# EAGLE design TrinTheremin (EAGLE 7.6.0)
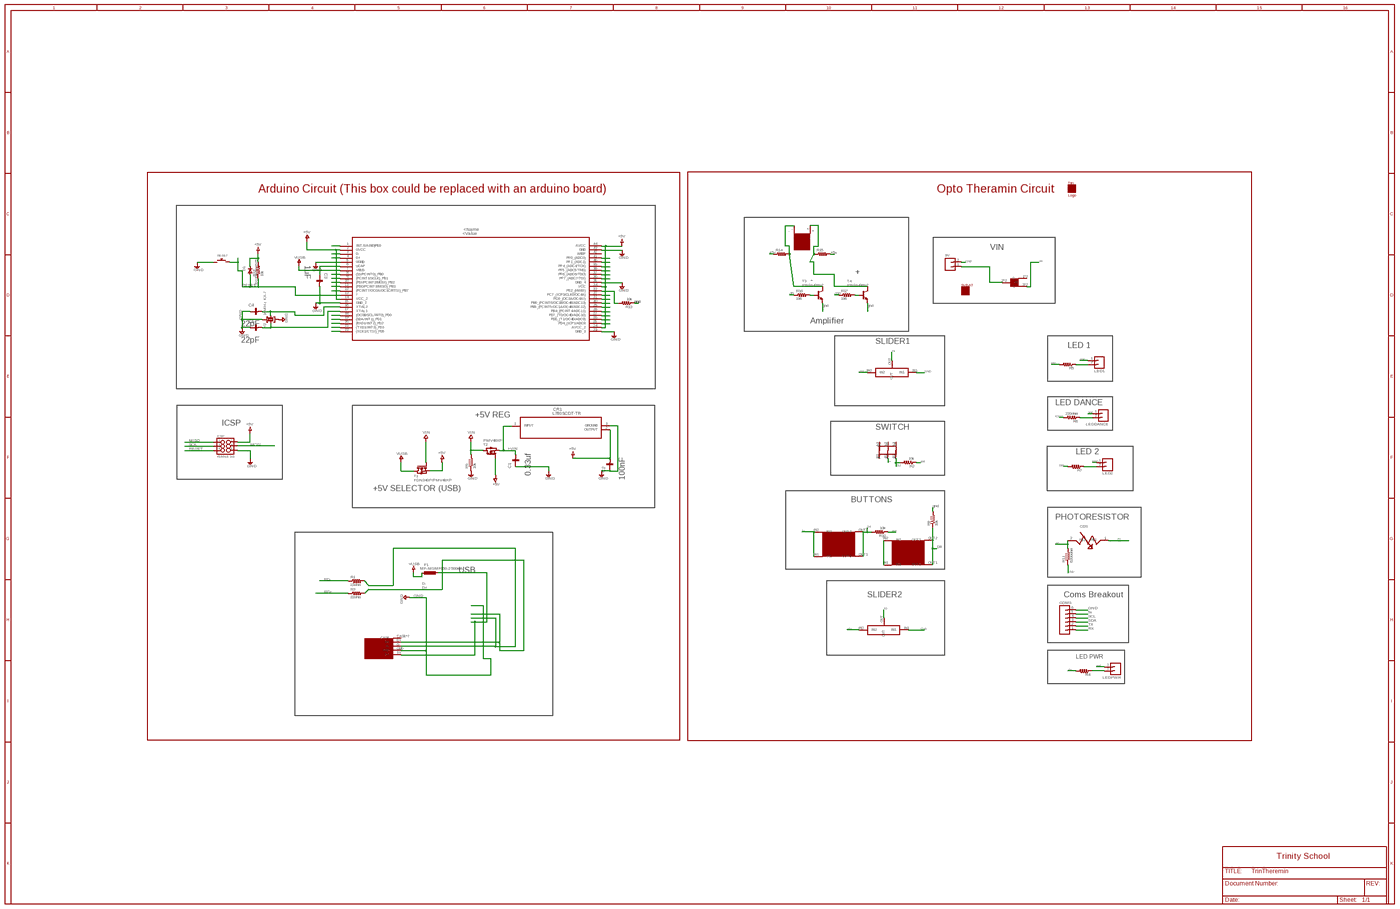
[diagram p0: schematic, sheet 1, overview]
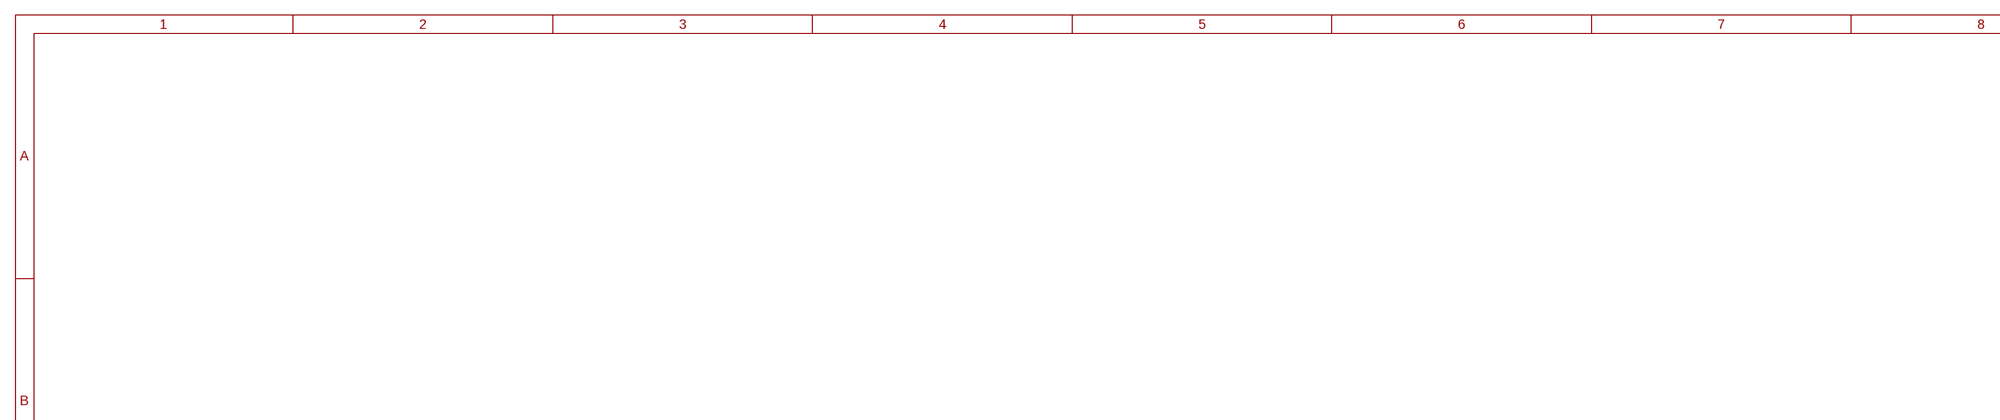
[diagram p1: schematic, sheet 1, part 1 of 4]
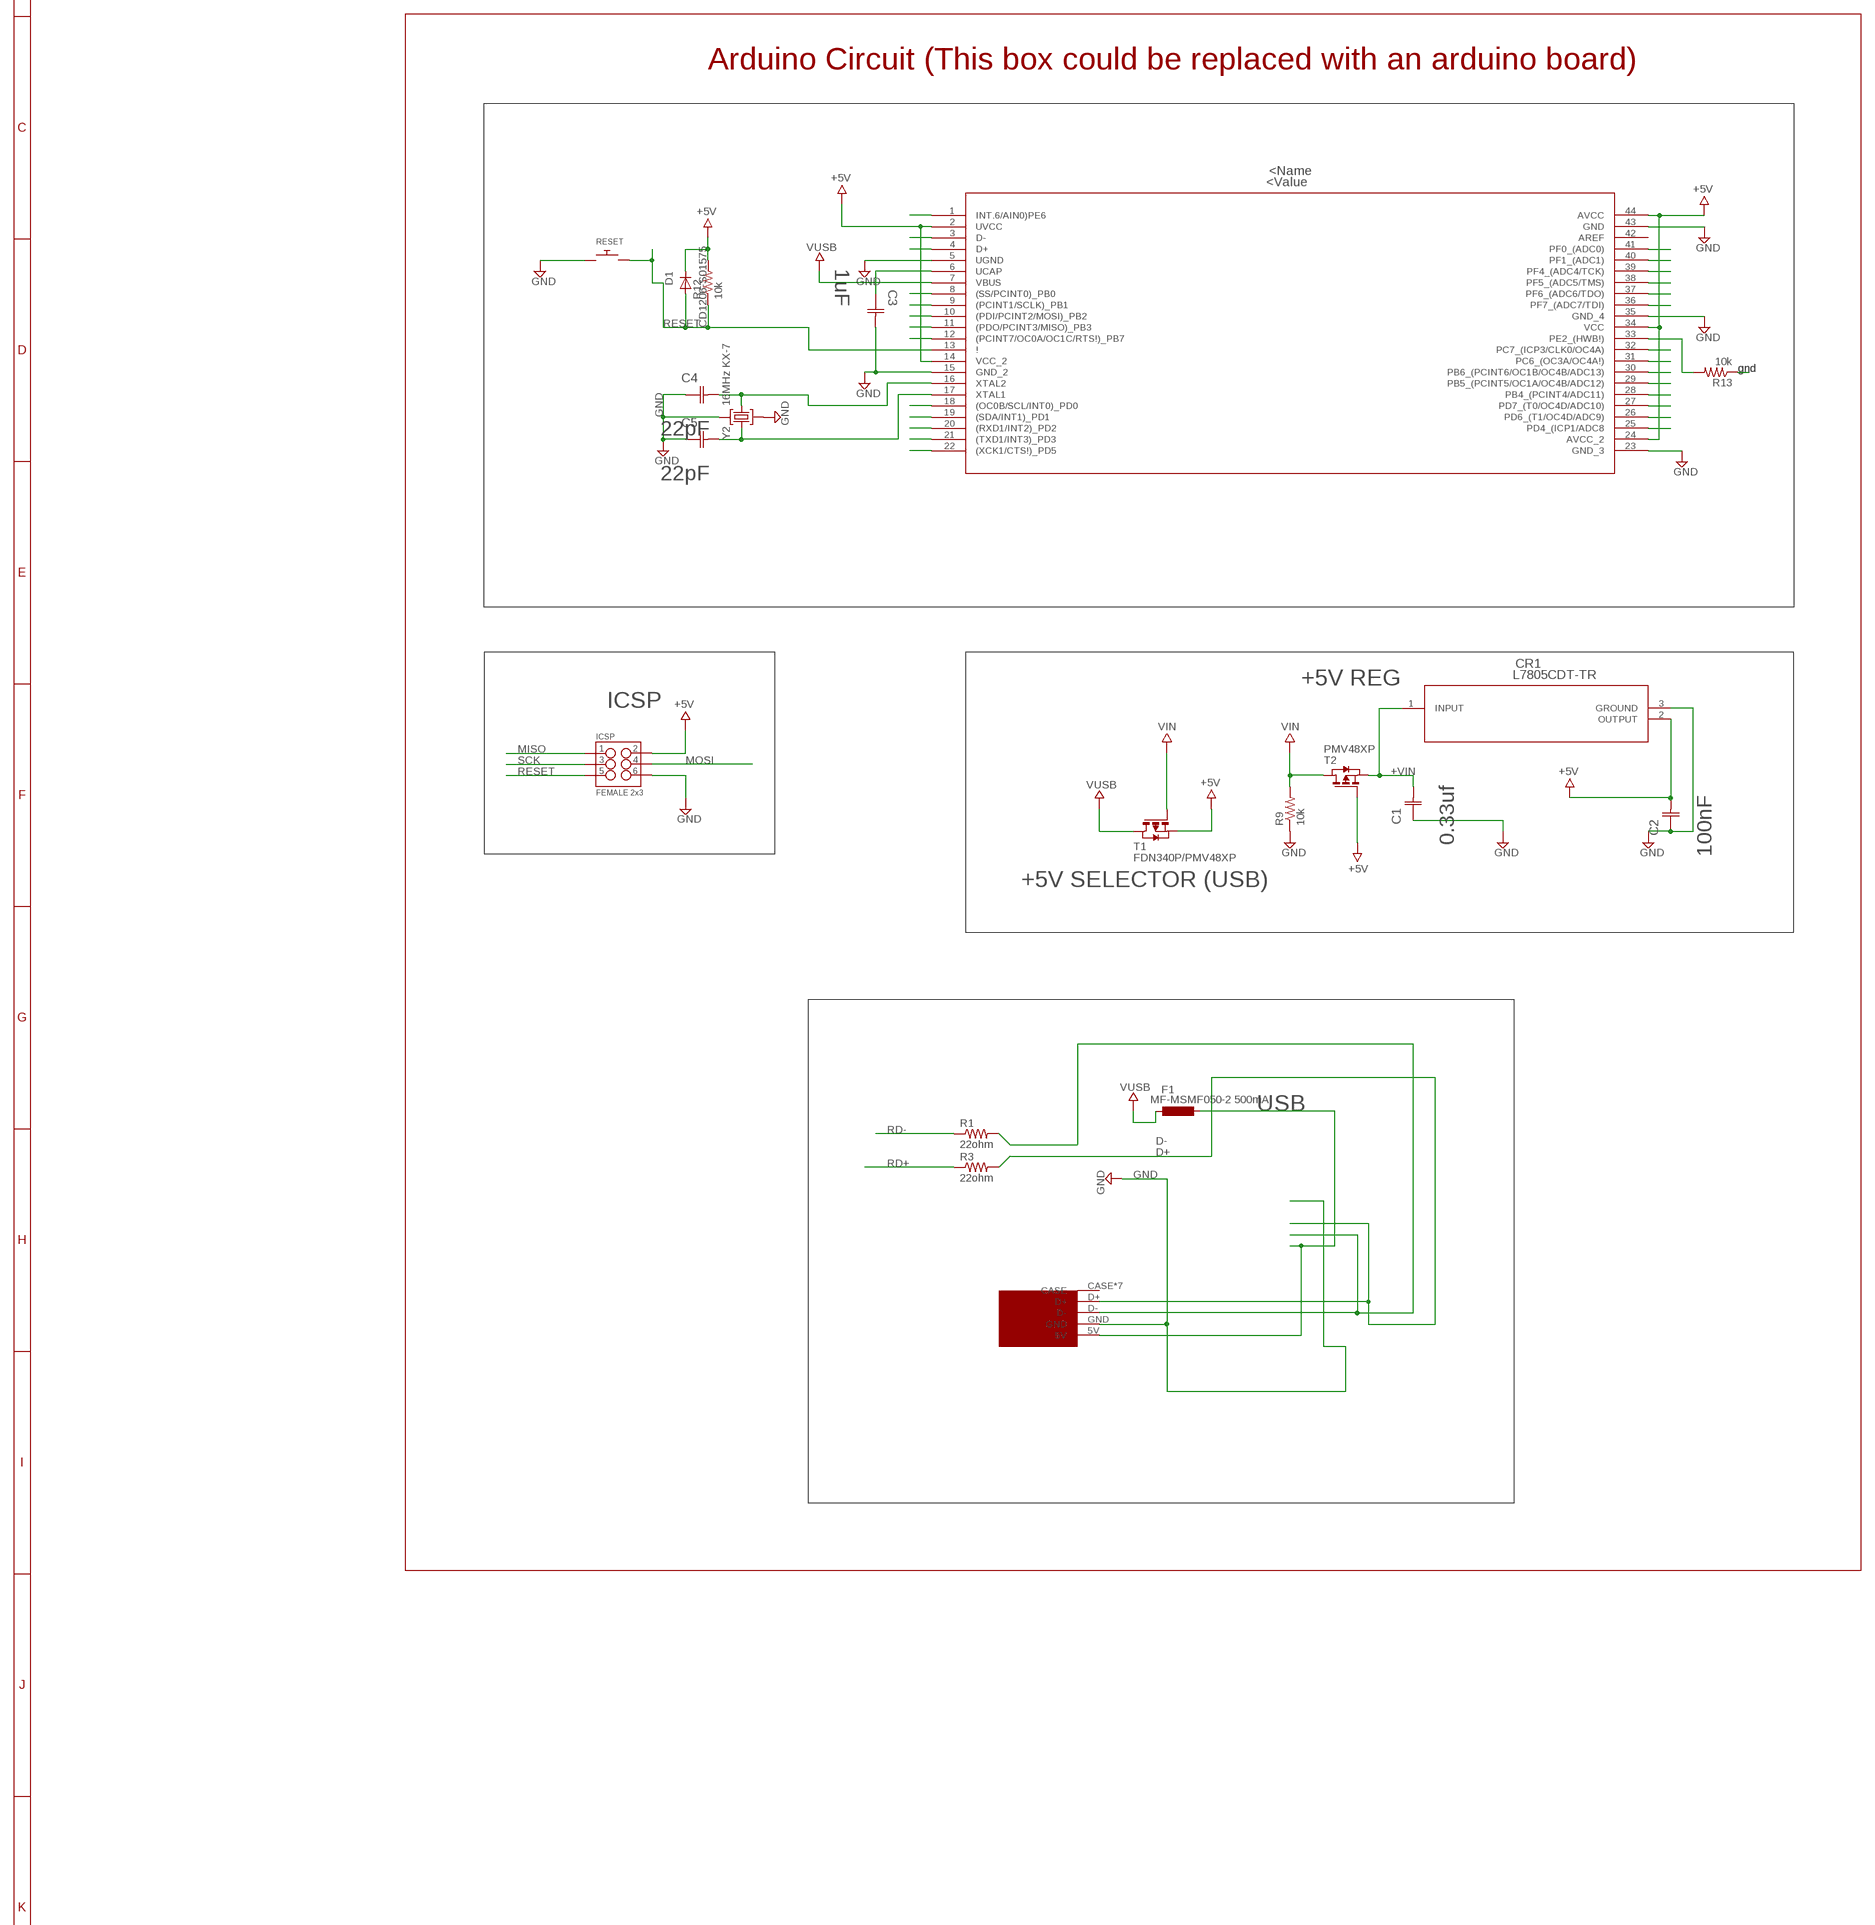
[diagram p2: schematic, sheet 1, part 2 of 4]
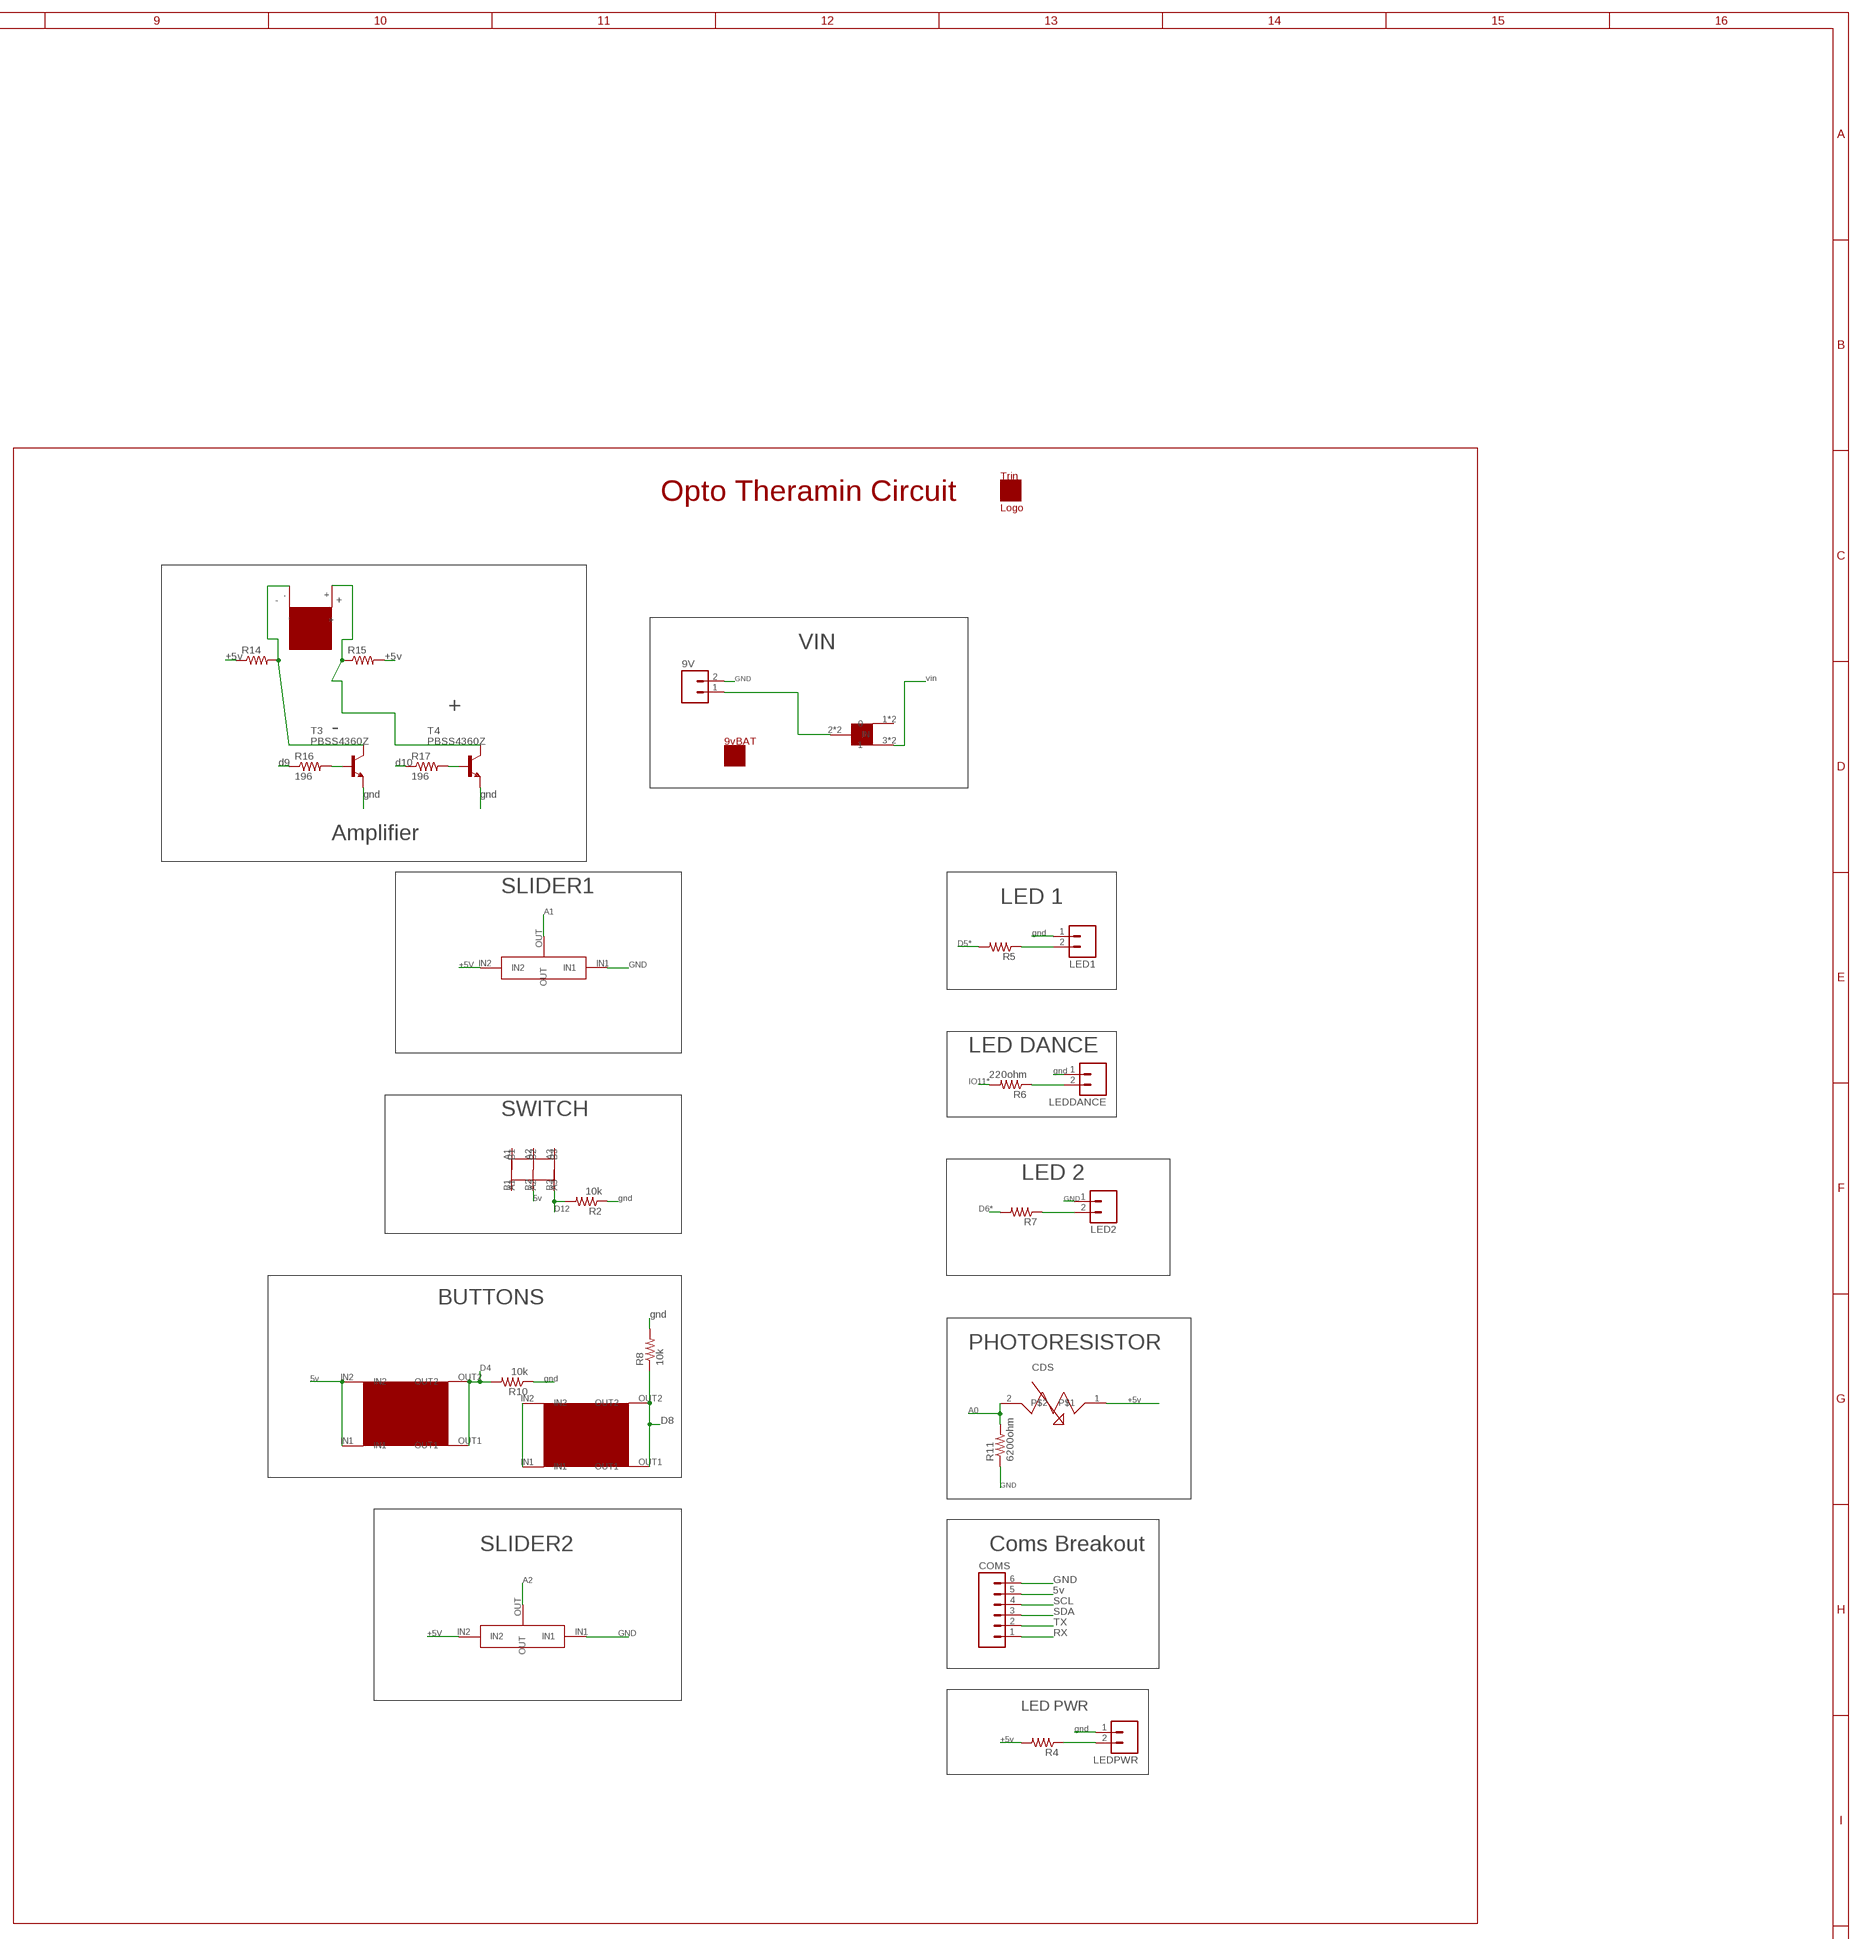
[diagram p3: schematic, sheet 1, part 3 of 4]
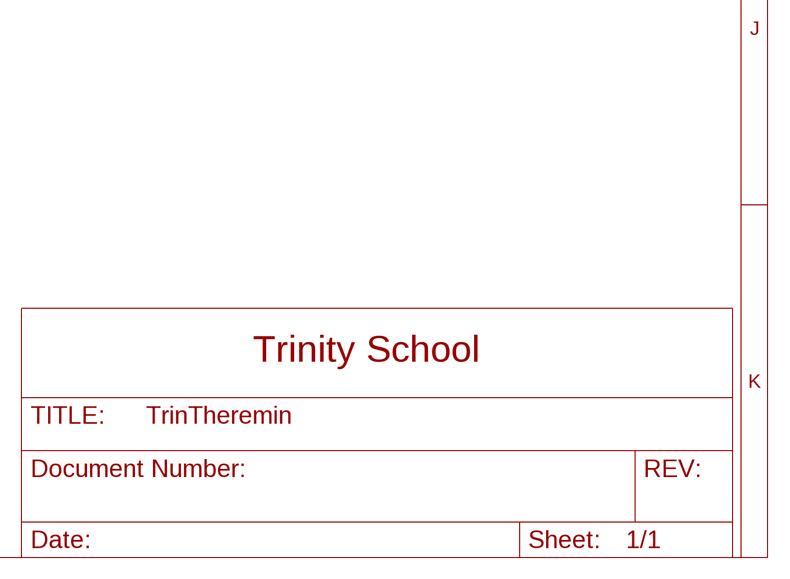
[diagram p4: schematic, sheet 1, part 4 of 4]

## Parts
9V  M02PTH  [1X02]
C1  0.33uf  C0805C104J5RACTU  [CAPC2013X110N]
C2  100nF  C0805C104J5RACTU  [CAPC2013X110N]
C3  1uF  C0603C105K3PACTU  [CAPC1608X85N]
C4  22pF  C0603C220J5GACTU  [CAPC1608X85N]
C5  22pF  C0603C220J5GACTU  [CAPC1608X85N]
COMS  M06SILK_FEMALE_PTH  [1X06]
CR1  L7805CDT-TR  [DPAK]
D1  CD1206-S01575  DIODE-MINIMELF  [MINIMELF]
F1  MF-MSMF050-2 500mA  L-EUL1812  [L1812]
ICSP  FEMALE 2x3  M03X2FEMALE  [2X3]
LED1  M02PTH  [1X02]
LED2  M02PTH  [1X02]
LEDDANCE  M02PTH  [1X02]
LEDPWR  M02PTH  [1X02]
R1  22ohm  R-US_R0603  [R0603]
R2  10k  RESISTOR0603  [0603-RES]
R3  22ohm  R-US_R0603  [R0603]
R4  RESISTOR0603  [0603-RES]
R5  RESISTOR0603  [0603-RES]
R6  220ohm  RESISTOR0603  [0603-RES]
R7  RESISTOR0603  [0603-RES]
R8  10k  RESISTOR0603  [0603-RES]
R9  10k  RESISTOR0603  [0603-RES]
R10  10k  RESISTOR0603  [0603-RES]
R11  6200ohm  RESISTOR0603  [0603-RES]
R12  10k  RESISTOR0603  [0603-RES]
R13  10k  RESISTOR0603  [0603-RES]
R14  R-US_R2512  [R2512]
R15  R-US_R2512  [R2512]
R16  196  RESISTOR1206  [1206]
R17  196  RESISTOR1206  [1206]
RESET  SWITCH_PUSHBUTTONC&K_KSS  [BTN_CK_KSS]
T1  FDN340P/PMV48XP  PMOSSOT23  [SOT-23]
T2  PMV48XP  PMOSSOT23  [SOT-23]
T3  PBSS4360Z  [SOT223]
T4  PBSS4360Z  [SOT223]
U$3  ATMEGA32U4-AU  [44ML]
U$8  PWRSWITCHTHRU  [PWRSWITCHTHRU]
U$9  CDS  [CDS]
U$10  DIGISLIDER  [DIGISLIDER]
U$11  DIGISWITCH  [DIGISWITCH]
U$13  BUT97  [BUT97]
U$14  DIGISLIDER  [DIGISLIDER]
U$15  9VBATHOLDERTALL  [9VBATHOLDERTALL]
U$16  TRIN  [TRIN]
U$17  BUT97  [BUT97]
U$20  GOODSPEAKER  [GOODSPEAKER]
U$23  MICROUSB  [MICROUSB]
Y2  16MHz KX-7  CRYSTAL-3.2-2.5  [CRYSTAL-3.2-2.5]

## Nets
+5V: C2.2(C2) COMS.5 CR1.2(OUTPUT) D1.C ICSP.2 R4.2 R12.2 R14.1 R15.2 T1.2(S) T2.3(G) U$3.2(UVCC) U$3.14(VCC_2) U$3.24(AVCC_2) U$3.34(VCC) U$3.44(AVCC) U$9.1 U$10.IN2 U$11.B2 U$13.IN1 U$13.IN2 U$14.IN2 U$17.IN1 U$17.IN2
+VIN: C1.2(C2) CR1.1(INPUT) T2.2(S)
A0: R11.2 U$3.36(PF7_(ADC7/TDI)) U$9.2
A1: U$3.37(PF6_(ADC6/TDO)) U$10.OUT
A2: U$3.38(PF5_(ADC5/TMS)) U$14.OUT
A3: U$3.39(PF4_(ADC4/TCK))
A4: U$3.40(PF1_(ADC1))
A5: U$3.41(PF0_(ADC0))
BASE: R16.2 T3.1(B)
COL: R14.2 T3.2(C) T3.4(C) U$20.-
D0/RX: COMS.1 U$3.20((RXD1/INT2)_PD2)
D1/TX: COMS.2 U$3.21((TXD1/INT3)_PD3)
D2/SDA: COMS.3 U$3.19((SDA/INT1)_PD1)
D3/SCL: COMS.4 U$3.18((OC0B/SCL/INT0)_PD0)
D4*: R10.2 U$3.25(PD4_(ICP1/ADC8) U$13.OUT1 U$13.OUT2
D5*: R5.2 U$3.31(PC6_(OC3A/OC4A!))
D6*: R7.2 U$3.27(PD7_(T0/OC4D/ADC10))
D7: U$3.1(INT.6/AIN0)PE6)
D+: R3.2 U$23.D+
D-: R1.2 U$23.D-
GND: 9V.2 C1.1(C1) C2.1(C1) C3.2(C2) C4.1(C1) C5.1(C1) COMS.6 CR1.3(GROUND) ICSP.6 LED1.1 LED2.1 LEDDANCE.1 LEDPWR.1 R2.1 R8.2 R9.1 R10.1 R11.1 R13.1 RESET.P$1 T3.3(E) T4.3(E) U$3.5(UGND) U$3.15(GND_2) U$3.23(GND_3) U$3.35(GND_4) U$3.43(GND) U$10.IN1 U$14.IN1 U$23.GND Y2.2(GND) Y2.4(GND)
HWB: R13.2 U$3.33(PE2_(HWB!))
IO8: R8.1 U$3.28(PB4_(PCINT4/ADC11)) U$17.OUT1 U$17.OUT2
IO9*: R16.1 U$3.29(PB5_(PCINT5/OC1A/OC4B/ADC12))
IO10*: R17.1 U$3.30(PB6_(PCINT6/OC1B/OC4B/ADC13))
IO11*: R6.2 U$3.12((PCINT7/OC0A/OC1C/RTS!)_PB7)
IO12*: R2.2 U$3.26(PD6_(T1/OC4D/ADC9)) U$11.B3
IO13*: U$3.32(PC7_(ICP3/CLK0/OC4A))
MISO: ICSP.1 U$3.11((PDO/PCINT3/MISO)_PB3)
MOSI: ICSP.4 U$3.10((PDI/PCINT2/MOSI)_PB2)
N$1: LED1.2 R5.1
N$2: R17.2 T4.1(B)
N$3: C3.1(C1) U$3.6(UCAP)
N$5: R15.1 T4.2(C) T4.4(C) U$20.+
N$6: LEDDANCE.2 R6.1
N$9: LED2.2 R7.1
N$10: 9V.1 U$8.2(IN) U$8.5(IN)
N$16: LEDPWR.2 R4.1
RAWUSB: F1.1 U$23.5V
RD+: R3.1 U$3.4(D+)
RD-: R1.1 U$3.3(D-)
RESET: D1.A ICSP.5 R12.1 RESET.P$2 U$3.13(!)
RXLED/SS: U$3.8((SS/PCINT0)_PB0)
SCK: ICSP.3 U$3.9((PCINT1/SCLK)_PB1)
TXLED: U$3.22((XCK1/CTS!)_PD5)
VIN: R9.2 T1.3(G) T2.1(D) U$8.3 U$8.6
VUSB: F1.2 T1.1(D) U$3.7(VBUS)
XTAL3: C4.2(C2) U$3.16(XTAL2) Y2.1(C1)
XTAL4: C5.2(C2) U$3.17(XTAL1) Y2.3(C2)
Unconnected: U$3.42(AREF) U$8.1 U$8.4 U$11.A1 U$11.A2 U$11.A3 U$11.B1 U$23.CASE U$23.CASE2(CASE) U$23.CASE3(CASE) U$23.CASE4(CASE) U$23.CASE5(CASE) U$23.CASE6(CASE) U$23.CASE7(CASE)

## Notes on the sheet
- Arduino Circuit (This box could be replaced with an arduino board) | Opto Theramin Circuit
- VIN
- +5v | +5v
- GND | vin
- +
- -
- d9 | d10
- gnd | gnd
- gnd | gnd
- Amplifier
- SLIDER1
- LED 1
- A1
- gnd
- D5*
- +5V | GND
- LED DANCE
- gnd
- +5V REG | IO11*
- ICSP
- SWITCH
- LED 2
- 5v | gnd | GND
- D12 | D6*
- +5V SELECTOR (USB)
- gnd
- BUTTONS
- PHOTORESISTOR
- D4 | CDS
- 5v | gnd
- +5v
- A0
- D8
- USB | GND
- SLIDER2 | Coms Breakout
- A2 | GND
- 5v
- SCL
- SDA
- TX
- +5V | GND | RX
- LED PWR
- gnd
- +5v
- Trinity School

## Library data of the parts
9V LED1 LED2 LEDDANCE LEDPWR = SparkFun-Connectors:M02: Standard 2-pin 0.1" header. Use with - straight break away headers ( PRT-00116) - right angle break away headers (PRT-00553) - swiss pins (PRT-00743) - machine pins (PRT-00117) - female headers (PRT-00115) Molex polarized connector foot print use with: PRT-08233 with associated crimp pins and housings. 2.54_SCREWTERM for use with PRT-10571. 3.5mm Screw Terminal footprints for PRT-08084 5mm Screw Terminal footprints for use with PRT-08432
C1 = Kemet_By_element14_Batch_1:C0805C104J5RACTU: CAPACITOR, 0805; MPN: C0805C104J5RACTU; OC_FARNELL: 1414663; OC_NEWARK: 64K2889; SUPPLIER: Kemet; TOLERANCE: ±5%; VALUE: 100nF; VOLTAGERATING: 50V
C2 = Kemet_By_element14_Batch_1:C0805C104J5RACTU: CAPACITOR, 0805; MPN: C0805C104J5RACTU; OC_FARNELL: 1414663; OC_NEWARK: 64K2889; SUPPLIER: Kemet; TOLERANCE: ±5%; VOLTAGERATING: 50V
C3 = Kemet_By_element14_Batch_1:C0603C105K3PACTU: CAPACITOR, 0603; MPN: C0603C105K3PACTU; OC_FARNELL: 1288202; OC_NEWARK: 93K5996; SUPPLIER: Kemet; TOLERANCE: ±10%; VOLTAGERATING: 25V
C4 C5 = Kemet_By_element14_Batch_1:C0603C220J5GACTU: CAPACITOR, 0603; MPN: C0603C220J5GACTU; OC_FARNELL: 1414622; OC_NEWARK: 64K2846; SUPPLIER: Kemet; TOLERANCE: ±5%; VOLTAGERATING: 50V
COMS = SparkFun-Connectors:M06: Header 6 Standard 6-pin 0.1" header. Use with straight break away headers (SKU : PRT-00116), right angle break away headers (PRT-00553), swiss pins (PRT-00743), machine pins (PRT-00117), and female headers (PRT-00115). Molex polarized connector foot print use with SKU : PRT-08094 with associated crimp pins and housings. NOTES ON THE VARIANTS LOCK and LOCK_LONGPADS... This footprint was designed to help hold the alignment of a through-hole component (i.e. 6-pin header) while soldering it into place. You may notice that each hole has been shifted either up or down by 0.005 of an inch from it's more standard position (which is a perfectly straight line). This slight alteration caused the pins (the squares in the middle) to touch the edges of the holes. Because they are alternating, it causes a "brace" to hold the component in place. 0.005 has proven to be the perfect amount of "off-center" position when using our standard breakaway headers. Although looks a little odd when you look at the bare footprint, once you have a header in there, the alteration is very hard to notice. Also,if you push a header all the way into place, it is covered up entirely on the bottom side. This idea of altering the position of holes to aid alignment will be further integrated into the Sparkfun Library for other footprints. It can help hold any component with 3 or more connection pins.; PROD_ID: CONN-08437
CR1 = Dpak:L7805CDT-TR; MANUFACTURER_PART_NUMBER: L7805CDTTR; VENDOR: ST Microelectronics
D1 = diode:DIODE-: DIODE
F1 = rcl:L-EU: INDUCTOR, European symbol
ICSP = SparkFun-Connectors:M03X2: 2x3 .1" header. Shrouded, with keying- CONN-10681 SMT- CONN-11415 Pogo pins- HW-11044; PROD_ID: CONN-11566
R1 R3 R14 R15 = adafruit:R-US_: RESISTOR, American symbol
R2 R4-R13 R16 R17 = SparkFun-Resistors:RESISTOR: Resistor Basic schematic elements and footprints for 0603, 1206, and PTH resistors.
RESET = adafruit:SWITCH_PUSHBUTTON: Buttons SOFTTOUCHSMD_SJ - Soft touch temporary push button (Super Junk Akihabara) Compatible with SKPMANE010 [Mouser: 688-SKPMAN] C&K_KSS = Digikey: KSS221GLFS
T1 T2 = zetex:PMOSSOT23: MOS FET
T3 T4 = NXP_60_26022015:PBSS4360Z: 60 V, 3 A NPN low VCEsat (BISS) transistor NPN low VCEsat Breakthrough In Small Signal (BISS) transistor in a medium power SOT223 (SC-73) Surface-Mounted Device (SMD) plastic package. PNP complement: PBSS5360Z. AAL Eindhoven MK
U$3 = 32u4:ATMEGA32U4-AU; COPYRIGHT: Copyright C 2015 Accelerated Designs. All rights reserved; MANUFACTURER_PART_NUMBER: ATMEGA32U4AU; VENDOR: Atmel
U$8 = OptoTher:PWRSWITCHTHRU
U$9 = OptoTher:CDS
U$10 U$14 = OptoTher:DIGISLIDER
U$11 = OptoTher:DIGISWITCH
U$13 U$17 = OptoTher:BUT97
U$15 = OptoTher:9VBATHOLDERTALL
U$16 = OptoTher:TRIN
U$20 = OptoTher:GOODSPEAKER
U$23 = OptoTher:MICROUSB
Y2 = SmartPrj:CRYSTAL-3.2-2.5

## Board
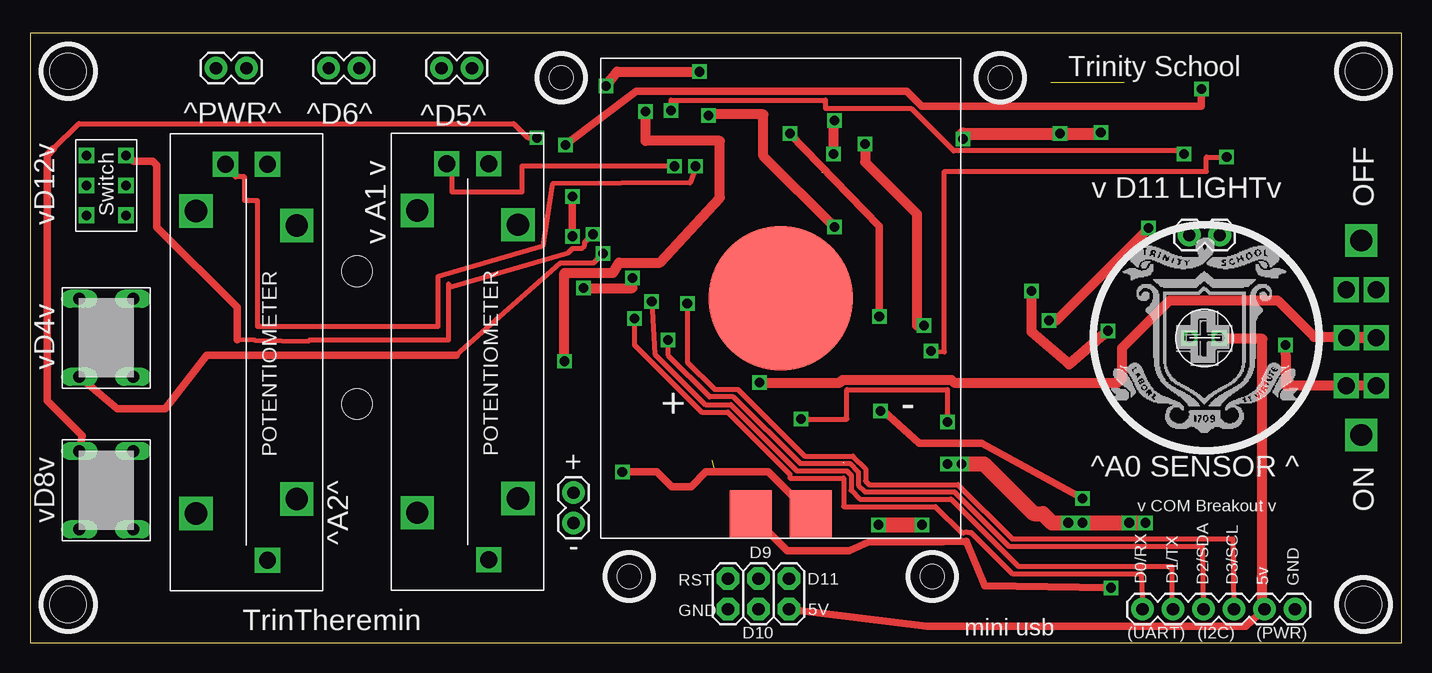
[diagram p5: board, top side]
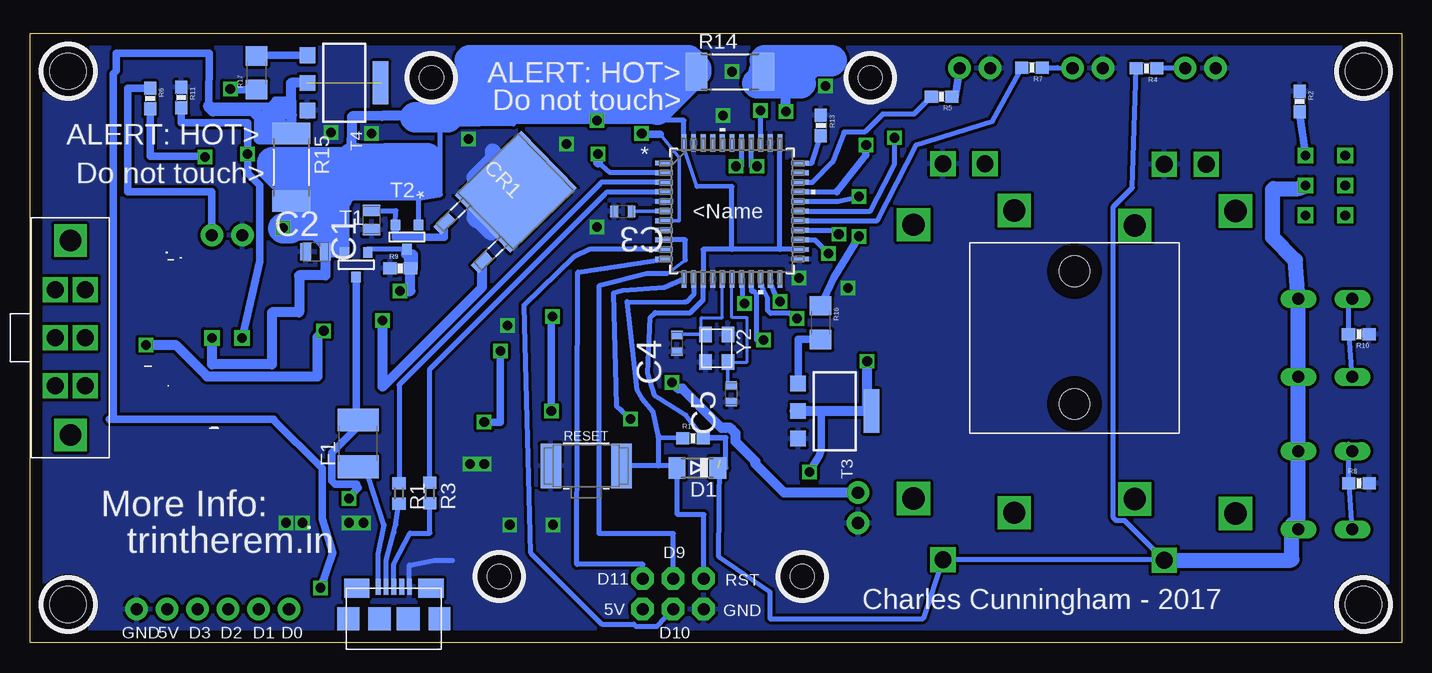
[diagram p6: board, bottom side, seen from below]

Size 114.3 x 50.8 mm. Coordinates in mm from the lower left corner, seen from the top.
Outline: 0,0 114.3,0 114.3,50.8 0,50.8 0,0
Copper layers (1*16): Top 0.035mm / dielectric 1.5mm / Bottom 0.035mm
Design rules "default": minimum track width 10mil, minimum drill 24mil, track to track 8mil, track to pad 8mil, pad to pad 8mil, via to via 8mil, smd to smd 8mil, copper to edge 40mil, drill to drill 8mil, minimum pad ring 10mil, minimum via ring 8mil, stop-mask expansion 4mil, vias tented up to drill 0mil, thermal gap 10mil
Holes 3 mm at 111.12,47.62 111.12,3.17 3.17,47.62 3.17,3.17
Holes 2 mm at 75.18,5.51 80.85,47.07 44.27,47.07 49.94,5.51

### Footprints (pad centres in the part's own frame; a part is rotated, then mirrored left to right if it is on the bottom)
1X02 = drill 1.016 pad 1.88: 1 0,0; 2 2.54,0
CAPC2013X110N = smd 0.914 x 1.448: 1 -0.813,0; 2 0.813,0
CAPC1608X85N = smd 0.66 x 0.94: 1 -0.711,0; 2 0.711,0
1X06 = drill 1.016 pad 1.88: 1 0,0; 2 2.54,0; 3 5.08,0; 4 7.62,0; 5 10.16,0; 6 12.7,0
DPAK = smd 0.94 x 1.702: 1 -2.25,-6.109; 2 2.25,-6.109 | smd 6.655 x 7.722: 3 0,0
MINIMELF = smd 1.4 x 1.8: A 1.7,0; C -1.7,0
L1812 = smd 1.9 x 3.4: 1 -1.95,0; 2 1.95,0
2X3 = drill 1.016 pad 1.88 octagon: 1 0,0; 2 0,2.54; 3 2.54,0; 4 2.54,2.54; 5 5.08,0; 6 5.08,2.54
R0603 = smd 1 x 1.1: 1 -0.85,0; 2 0.85,0
0603-RES = smd 1.1 x 1: 1 -0.85,0; 2 0.85,0
R2512 = smd 1.8 x 3.2: 1 -2.8,0; 2 2.8,0
1206 = smd 1.6 x 1.8: 1 -1.4,0; 2 1.4,0
BTN_CK_KSS = smd 1.7 x 3.7: P$1 -2.95,0; P$2 2.95,0
SOT-23 = smd 0.787 x 0.889: 1 0.025,-1.016; 2 -0.94,1.016; 3 0.991,1.016
SOT223 = smd 1.3 x 1.3: 1 -2.3,-3.05; 2 0,-3.05; 3 2.3,-3.05 | smd 3.6 x 1.3: 4 0,3.05
44ML = smd 1.473 x 0.406: 1 -5.664,4; 2 -5.664,3.2; 3 -5.664,2.4; 4 -5.664,1.6; 5 -5.664,0.8; 6 -5.664,0; 7 -5.664,-0.8; 8 -5.664,-1.6; 9 -5.664,-2.4; 10 -5.664,-3.2; 11 -5.664,-4; 23 5.664,-4; 24 5.664,-3.2; 25 5.664,-2.4; 26 5.664,-1.6; 27 5.664,-0.8; 28 5.664,0; 29 5.664,0.8; 30 5.664,1.6; 31 5.664,2.4; 32 5.664,3.2; 33 5.664,4 | smd 0.406 x 1.473: 12 -4,-5.664; 13 -3.2,-5.664; 14 -2.4,-5.664; 15 -1.6,-5.664; 16 -0.8,-5.664; 17 0,-5.664; 18 0.8,-5.664; 19 1.6,-5.664; 20 2.4,-5.664; 21 3.2,-5.664; 22 4,-5.664; 34 4,5.664; 35 3.2,5.664; 36 2.4,5.664; 37 1.6,5.664; 38 0.8,5.664; 39 0,5.664; 40 -0.8,5.664; 41 -1.6,5.664; 42 -2.4,5.664; 43 -3.2,5.664; 44 -4,5.664
PWRSWITCHTHRU = drill 1.4 square: 1 -4,-1.25; 2 0,-1.25; 3 4,-1.25; 4 -4,1.25; 5 0,1.23; 6 4,1.25 | drill 1.8 square: STRUCT1 8.1,0; STRUCT2 -8.1,0
CDS = drill 0.8 square: 1 -1,0; 2 1.5,0
DIGISLIDER = drill 1.85 square: HOLD1 -11.4,4.2; HOLD2 11.4,4.2; HOLD3 -12.6,-4.2; HOLD4 12.6,-4.2 | drill 1.4 square: IN1 -16.5,1.75; IN2 16.5,1.75; OUT -16.5,-1.75
DIGISWITCH = drill 0.8 square: A1 -2.489,1.651; A2 0,1.651; A3 2.489,1.651; B1 -2.489,-1.651; B2 0,-1.651; B3 2.489,-1.651
BUT97 = drill 1 long: IN1 -2.248,-3.251; IN2 -2.248,3.251; OUT1 2.248,-3.251; OUT2 2.248,3.251
9VBATHOLDERTALL = hole 2.54: 0,5.55; 0,-5.5
GOODSPEAKER = smd 3.5 x 4: + -2.5,-18; - 2.5,-18 | smd 12 x 12: PAD 0,0
MICROUSB = smd 0.4 x 1.35: 5V -1.3,2.675; CASE7 0.65,2.675; D+ 0,2.675; D- -0.65,2.675; GND 1.3,2.675 | smd 1.8 x 1.9: CASE -3.8,0; CASE4 3.8,0 | smd 1.9 x 1.9: CASE2 -1.2,0; CASE3 1.2,0 | smd 2.1 x 1.6: CASE5 3.1,2.55; CASE6 -3.1,2.55
CRYSTAL-3.2-2.5 = smd 1.3 x 1.05: 1 -1.15,-0.925; 2 1.15,-0.925; 3 1.15,0.925; 4 -1.15,0.925

### Placement (x,y rotation side)
9V  45.3,12.5 270 top
C1  85.84,35.21 90 bottom
C2  90.5,32.57 0 bottom
C3  64.89,35.94 180 bottom
C4  60.38,24.94 90 bottom
C5  55.86,20.74 90 bottom
COMS  92.71,2.79 0 top
CR1  73.82,37.59 314.3 bottom
D1  58.69,14.56 180 bottom
F1  86.94,16.6 90 bottom
ICSP  63.25,5.33 180 top
LED1  34.29,47.88 0 top
LED2  24.89,47.88 0 top
LEDDANCE  96.61,33.95 0 top
LEDPWR  15.49,47.88 0 top
R1  83.56,12.44 270 bottom
R2  8.51,45.09 270 bottom
R3  80.99,12.46 270 bottom
R4  21.25,47.85 180 bottom
R5  38.33,45.5 180 bottom
R6  104.3,45.34 270 bottom
R7  30.79,47.92 180 bottom
R8  3.56,13.29 0 bottom
R9  83.45,31.19 0 bottom
R10  3.57,25.7 180 bottom
R11  101.69,45.43 270 bottom
R12  59.04,17.03 0 bottom
R13  48.39,43.1 270 bottom
R14  55.96,47.58 0 bottom
R15  92.53,39.62 270 bottom
R16  48.42,26.67 270 bottom
R17  95.41,47.49 90 bottom
RESET  67.95,14.72 0 bottom
T1  87.15,31.49 0 bottom
T2  82.91,33.8 0 bottom
T3  47.24,19.3 270 bottom
T4  88.13,46.65 270 bottom
U$3  55.8,35.97 0 bottom
U$8  110.94,25.4 270 bottom
U$9  98.13,25.4 180 top
U$10  36.47,23.42 270 top
U$11  6.35,38.1 90 top
U$13  6.35,25.4 180 top
U$14  18.03,23.37 270 top
U$15  27.25,25.4 0 bottom
U$16  97.78,25.4 0 top
U$17  6.35,12.7 180 top
U$20  62.56,28.7 0 top
U$23  83.98,1.98 0 bottom
Y2  57.07,24.54 270 bottom

### Tracks (layer width: path | path; a pad name or v marks a point on that pad's centre or on a via)
+5V  (via drill 0.8)  (2 unrouted)
  Top 0.61: ICSP.2 74.74,1.35 92.02,1.35 101.33,1.35 COMS.5
  Top 0.813: v66.97,40.72 66.97,43.51 v67.05,43.51 | v84.91,26.84 85.5,26.84 v93.21,34.54 | COMS.5 102.69,2.79 102.69,25.31 99.13,25.31 U$9.1
  Bottom 0.254: 51.8,32.77 U$3.24 55.8,32.77 | 59.68,40.87 U$3.44 | T2.3 | T1.2 | D1.C 56.32,14.56 | 82.64,37.06 82.91,37.06 82.91,37.05
  Bottom 0.305: 58.72,38 59.68,40.87
  Bottom 0.406: U$3.24 58.2,32.77 U$3.14 58.2,28.56 59.26,27.5 62.21,27.5 62.6,27.12 62.83,22.44 62.22,20.56 59.64,18.96 58.18,17.09 56.32,17.09 | 51.8,32.77 U$3.34 | 55.8,32.77 55.8,38.02 58.72,38 | 81.92,37.05 80.16,37.33 80.11,37.33 80.11,43.23 73.99,43.23 73.99,43.51 v67.05,43.51 59.8,43.51 U$3.44 | T2.3 81.92,37.05 | 88.09,37.06 82.91,37.06 | U$3.2 65.98,39.17 | 56.82,15.22 56.88,7.14 52.65,4.23 52.65,2.01 39.87,2.01 U$10.IN2 | 56.32,14.56 56.32,17.09 | 81.92,37.05 82.91,37.05 | 89.69,32.51 C2.2 | R12.2 56.32,17.09 | 37.95,6.87 U$10.IN2 | U$10.IN2 19.78,6.92 U$14.IN2 23.09,10.17 23.79,10.17 24.03,10.41 24.03,36.32 22.44,37.91 R4.2 | 66.97,40.03 65.98,39.18
  Bottom 0.813: 88.09,37.06 T1.2 | T1.2 89.69,32.51 | C2.2 89.69,30.61 91.87,30.61 91.87,27.51 94.14,27.51 94.14,23.2 99.13,23.2 U$9.1 | v66.97,40.72 66.97,40.03 | v67.05,43.51 67.05,47.41 72.9,47.41 75.94,44.37 76.89,43.41 78.61,43.41 78.96,43.77 79.05,43.84 83.08,43.89 84.97,43.89 87.45,43.86 87.5,40.38 87.52,38.44 87.54,37.16 88.64,37.16 | R15.2 92.53,35.22 v93.21,34.54 | v84.91,26.84 84.91,21.33 76.62,29.62 CR1.2
  Bottom 1.27: U$14.IN2 9.22,6.87 9.14,6.94 9.14,9.83 U$17.IN2 U$17.IN1 U$13.IN2 U$13.IN1 8.85,31.88 10.75,33.78 10.75,37.76 10.67,37.84 8.59,37.84 U$11.B2
  Bottom 2.54: R14.1 58.76,47.84 59.43,48.51 77.65,48.51 77.56,48.43 77.56,45.7 78.74,44.53 | 82.21,43.78 79.49,43.78 78.74,44.53 | 78.74,44.53 77.72,44.53 75.69,46.56 59.87,46.56 58.94,47.49 58.94,47.48 62.02,44.4 62.11,44.49 75.82,44.49 75.94,44.37 | R15.2 88.98,36.82 88.64,37.16 | v93.21,34.54 92.61,34.54 92.38,34.77 89.34,34.77 89.31,34.8 89.31,33.86 89.33,33.86 90.24,34.77 91.15,34.77 91.43,35.05 91.43,36.9 94.1,39.56 94.1,40.05 88.39,40.05 88.38,40.04 88.38,39.11 88.55,38.94 90.5,38.94 90.58,38.86 81.19,38.86 81.19,38.35 87.43,38.35 87.52,38.44 | 87.5,40.38 87.1,40.38 87.06,40.34 84.63,40.34 84.59,40.38 81.19,40.38
+VIN
  Bottom 0.254: T2.2 | C1.2 85.17,36
  Bottom 0.406: T2.2 83.81,36.01 85.17,36
  Bottom 0.61: T2.2 83.86,33.8 79.77,33.8 CR1.1
A0  (via drill 0.8)
  Top 0.406: v96.17,40.72 95.92,40.98 76.98,40.98 73.43,44.52 66.29,44.52 | v53.42,44.36 53.42,45.21 66.29,45.21 66.29,44.52 | 66.29,44.52 66.28,44.52
  Bottom 0.406: v53.42,44.36 53.42,41.63 U$3.36
  Bottom 0.61: R11.2 101.67,44.58 101.67,43.34 96.17,43.34 v96.17,40.72 96.17,39.12 95.16,38.11 95.16,31.78 U$9.2
A1  (via drill 0.8)
  Top 0.406: v53.72,39.7 41,39.7 41,37.54 35.18,37.54 35.18,39.85 34.45,39.85 U$10.OUT
  Bottom 0.406: v53.72,39.7 54.2,39.7 U$3.37
A2  (via drill 0.8)
  Top 0.406: v55.47,39.7 55.52,39.7 55.02,38.31 43.54,38.23 42.72,33.05 33.98,30.5 33.98,26.33 18.97,26.33 18.97,36.83 17.88,36.83 17.88,38.81 17.12,38.81 U$14.OUT
  Bottom 0.406: v55.47,39.7 55,39.7 U$3.38
BASE
  Bottom 0.61: R16.2 50.29,25.27 T3.1
COL  (via drill 0.8)
  Top 0.61: U$20.- 61.54,14.22 56.32,14.22 55.09,12.99 53.47,12.99 52.24,14.22 v49.36,14.22
  Top 0.813: v51.3,44.28 51.3,41.82 57.48,41.82 57.48,37.08 52.49,31.66 49.1,31.66 48.59,30.82 44.53,30.82 v44.53,23.45
  Bottom 0.61: v49.36,14.22 48.51,15.58 48.37,16.06 48.37,19.22 50.57,19.3
  Bottom 0.813: 50.57,19.3 T3.2 T3.4 44.53,19.3 v44.53,23.45 | v51.3,44.28 51.3,47.49 R14.2
  Bottom 2.54: R14.2 50.11,47.58 49.21,48.47 47.52,48.47 47.47,48.51 53.09,48.51 51.98,48.51 50.08,46.61 53.71,46.61
D0/RX  (via drill 0.8)
  Top 0.406: 77.63,9.17 75.46,11.34 67.81,11.34 67.81,13.71 63.32,13.71 63.32,14.05 58.16,19.22 55.96,19.22 50.37,24.8 v50.37,27.01 | 77.63,9.17 | 77.63,9.17 77.87,9.17 78.02,9.24 78.16,9.18 78.3,9.18 78.32,9.17 78.45,9.17 81.86,5.76 92.62,5.76 COMS.1
  Bottom 0.406: v50.37,27.01 51.02,27.46 51.04,27.44 52.58,27.44 52.82,27.67 52.82,28.73 53.23,29.47 U$3.20
D1/TX  (via drill 0.8)
  Top 0.406: v51.81,28.45 52.06,24.04 56.28,19.83 58.41,19.83 63.92,14.32 68.06,14.32 68.42,13.97 68.42,12.68 69.15,11.95 76.77,11.95 82.36,6.37 92.36,6.37 | 92.36,6.37 | 92.36,6.37 92.87,6.37 92.89,6.35 95.16,6.35 95.16,2.79 COMS.2
  Bottom 0.406: U$3.21 52.57,30.3 52.57,29.88 52.06,28.61 v51.81,28.45
D2/SDA  (via drill 0.8)
  Top 0.406: v53.17,25.23 53.17,23.96 56.64,20.49 58.62,20.49 64.17,14.93 68.32,14.93 69.03,14.22 69.03,13.12 69.59,12.56 77.02,12.56 81.54,8.04 97.7,8.04 COMS.3
  Bottom 0.406: U$3.19 54.18,30.3 54.18,29.29 54.17,29.29 54,29.29 53.76,29.04 53.76,27.18 53.76,25.23 v53.17,25.23
D3/SCL  (via drill 0.8)
  Top 0.406: v54.77,28.28 54.77,23.37 57.04,21.1 58.99,21.1 64.54,15.54 68.57,15.54 69.64,14.47 69.64,13.46 69.93,13.17 77.33,13.17 81.85,8.65 100.24,8.65 COMS.4
  Bottom 0.406: U$3.18 54.94,30.3 54.94,28.28 v54.77,28.28
D4*  (via drill 0.8)
  Top 0.406: v47.75,32.42 46.95,31.63 44.19,31.63 35.51,23.96
  Top 0.61: 35.51,23.96 14.73,23.96 11.26,19.47 7.28,19.47 U$13.OUT2
  Bottom 0.406: U$3.25 48.89,33.57 v47.75,32.42 | U$13.OUT2 4.35,25.63 R10.2 4.42,28.83 U$13.OUT1
D5*
  Bottom 0.406: U$3.31 49.09,38.37 47.4,40.06 46.46,42.54 44.76,42.54 43.25,44.04 40.64,44.04 R5.2
D6*
  Bottom 0.406: U$3.27 43.68,35.17 40.46,41.49 34.1,43.43 R7.2
D+
  Bottom 0.406: R3.2 80.99,9.12 82.65,9.12 83.98,6.55 U$23.D+
D-
  Bottom 0.406: R1.2 83.81,9.86 83.98,9.18 84.63,6.87 U$23.D-
GND  (via drill 0.8)
  Top 0.813: v69.59,41.57 69.59,40.04 73.91,35.73 73.91,26.41 v74.5,26.41 | v56.55,43.94 56.55,44.02 61.12,44.02 61.12,40.55 v67.05,34.62 | v46.14,29.55 50.2,29.55 v50.2,30.39 | v48,46.39 48.93,47.58 v55.79,47.58
  Top 1.016: v77.75,41.99 77.75,42.41 v85.84,42.41 89.23,42.41 v89.23,42.5
  Top 1.27: v70.71,9.82 v74.32,9.82 | v76.45,14.9 79.5,14.9 83.64,10.75 84.41,10.75 85.17,9.99 v87.71,9.99 | v86.52,9.99 v92.95,9.99
  Bottom 0.406: 70.9,14.71 RESET.P$1 | U$23.GND 82.68,6.46 80.59,6.86 79.07,6.86
  Bottom 1.27: CR1.3 73.82,39.03 75.77,40.98 75.77,40.3 77.29,38.77 77.29,35.39 77.04,35.13 76.87,35.13 75.85,34.12
  other vias: 77.63,14.9 91.6,9.99
  pour Bottom (isolate 0.254): 0,50.8 0,0 114.3,0 114.3,50.8
HWB
  Bottom 0.406: U$3.33 49.15,39.97 R13.2
IO8  (via drill 0.8)
  Top 0.406: 1.95,41.14 4.06,43.26 40.3,43.26 41.48,42.08 v42.24,42.08
  Top 0.61: U$17.OUT1 4.35,17.24 1.44,20.15 1.44,40.64 1.95,41.14
  Bottom 0.406: U$3.28 44.26,35.97 43.09,38.27 42.24,39.93 v42.24,42.08 | U$17.OUT2 4.35,13.23 R8.1 4.41,16.57 U$17.OUT1
IO9*  (via drill 0.8)
  Top 0.61: v45.21,37.16 v45.21,33.86
  Bottom 0.406: U$3.29 46.99,36.77 v45.21,37.16
  Bottom 0.61: v45.21,33.86 47.32,30.39 R16.1
IO10*  (via drill 0.8)
  Top 0.61: v44.61,41.48 50.51,45.94 73.05,45.94 74.3,44.7 97.61,44.7 v97.61,46.14
  Bottom 0.406: U$3.30 47.07,37.57 47.07,37.59
  Bottom 0.61: R17.1 97.61,46.09 v97.61,46.14 | 47.07,37.59 44.64,40.61 44.64,41.48 v44.61,41.48
IO11*  (via drill 0.8)
  Top 0.406: v99.73,40.47 98.03,40.47 98.03,39.28 76.19,39.28 76.19,24.21 v75.09,24.3 | v64.26,18.62 68.07,18.62 68.07,21.08 76.45,21.08 v76.45,18.37
  Bottom 0.406: U$3.12 61.44,29.59 64.91,29.34 65.7,29.14 65.44,19.73 65.02,19.39 v64.26,18.62 | 99.73,40.42 v99.73,40.47
  Bottom 0.61: v99.73,40.47 99.73,40.55 104.3,40.55 R6.2 | v75.09,24.3 75.09,18.37 v76.45,18.37
IO12*  (via drill 0.8)
  Top 0.406: 17.27,25.48 17.27,25.22 18.72,25.21 23.21,25.13 23.28,25.23 34.88,25.23 34.88,29.88 34.95,29.63 44.87,32.51 45.21,32.85 45.98,32.85 46.22,33.09 46.22,33.35 v46.9,34.03
  Top 0.61: 17.27,25.22 17.27,27.94 10.58,34.62 10.58,39.79 10.24,40.13 8.63,40.13 U$11.B3
  Bottom 0.406: U$3.26 46.9,34.37 v46.9,34.03
  Bottom 0.61: U$11.B3 R2.2
MISO
  Bottom 0.254: 61.47,31.95 U$3.11
  Bottom 0.406: 61.47,31.95 68.64,30.88 68.72,6.52 63.21,6.52 63.24,6.49 ICSP.1
MOSI
  Bottom 0.406: U$3.10 67.67,32.78 68.96,32.16 73.12,28.12 72.55,7.45 66.64,1.54 63.97,1.54 63.8,1.36 62.05,1.36 ICSP.4
N$1
  Bottom 0.61: LED1.2 37.21,45.5 R5.1
N$2
  Bottom 0.61: T4.1 95.41,48.95 R17.2
N$3
  Bottom 0.305: U$3.6 63.56,35.97 C3.1
N$5  (via drill 0.8)  (1 unrouted)
  Top 0.61: U$20.+ 63.12,7.64 68.26,7.64 69.93,8.42 76.12,8.42 78.02,8.47 79.58,4.74 v90.08,4.57
  Bottom 0.61: v90.08,4.57 89.06,7.47 89.97,10.32 89.97,14.53 94.06,18.62 93.97,18.62 107.69,18.62 107.35,18.62 107.35,47.41 107.09,47.67 107.09,49.1 99.35,49.1 99.35,48.98 99.39,44.7 95.16,44.7 94.3,44.7 93.88,45.21 92.53,45.21
  Bottom 0.813: T4.2 92.53,46.65 92.53,45.21 R15.1
  Bottom 1.016: R15.1 93.38,43.26 93.8,43.26 | 93.8,43.26 93.97,43.09 93.97,42.24 94.19,42.03 95.16,42.03 95.16,43.77 95.75,44.36 99.05,44.36 99.39,44.7 | 93.8,43.26 94.48,43.26 94.48,43.01 94.56,42.92 94.56,44.11 92.67,44.11 92.54,43.97 92.57,43.97 93.12,44.53 93.72,44.53
N$6
  Bottom 0.61: LEDDANCE.2 99.14,37.59 106.16,37.59 106.16,46.19 R6.1
N$9
  Bottom 0.406: R7.1 28.66,47.92 LED2.2
N$10  (via drill 0.8)
  Top 0.813: v60.78,21.67 67.51,21.67 67.73,21.89 76.78,21.89 77.02,21.66 90.66,21.66 91.02,22.02 91.02,24.56 94.99,28.53 103.96,28.53 107.01,25.48 112.19,25.48 U$8.2 U$8.5
  Bottom 0.813: 9V.1 51.45,12.5 53.84,14.9 53.84,15.1 55.49,16.75 55.49,16.79 55.5,17.11 55.5,17.43 55.52,17.44 55.52,17.46 55.75,17.68 55.98,17.91 56,17.91 56.01,17.92 56.33,17.91 56.65,17.91 56.68,17.91 59.94,21.16 60.28,21.16 v60.78,21.67
N$16
  Bottom 0.406: LEDPWR.2 17.37,47.85 R4.1
RAWUSB
  Bottom 0.406: F1.1 86.07,13.72 84.8,9.83 85.31,7.38 85.31,5.78 U$23.5V
RD+
  Bottom 0.254: 61.48,37.56 U$3.4 | 66.38,37.4
  Bottom 0.406: R3.1 80.99,22.8 66.38,37.4 66.23,37.56 61.48,37.56
RD-
  Bottom 0.254: 66.81,38.26 66.81,38.21 | 82.29,22.73 | 83.55,13.3 R1.1
  Bottom 0.406: U$3.3 66.71,38.37 66.81,38.26 | 66.81,38.21 82.29,22.73 | 82.29,22.73 83.55,21.48 83.55,13.3
RESET
  Bottom 0.254: 64.64,28.43 64.53,28.43 | D1.A 61.93,14.73 | U$3.13 | 59.62,28.39 59.75,28.39
  Bottom 0.406: 59.75,28.39 64.53,28.43 63.69,21.02 63.3,20.3 62.36,19.25 61.93,17.29 61.93,17.09 | 61.93,17.09 61.93,14.73 | U$3.13 58.99,29.02 59.62,28.39 | R12.1 61.93,17.09 | 60.39,14.72 RESET.P$2 | D1.A 60.36,14.56 60.36,10.67 58.13,10.67 58.16,10.63 ICSP.5
  Bottom 0.61: 60.39,14.72 D1.A
SCK
  Bottom 0.305: 61.21,30.75 59.69,31.88
  Bottom 0.406: 59.69,31.88 59.69,33.57 U$3.9 | 61.21,30.75 62.89,30.76 66.87,29.74 66.87,9.08 60.67,9.08 60.7,9.05 ICSP.3
VIN  (via drill 0.8)
  Top 0.813: 112.27,21.42 U$8.3 U$8.6 104.72,21.4 v104.64,24.8 | v89.82,25.99 86.59,23.2 83.47,25.89 v83.47,29.29
  Bottom 0.254: 86.16,32.78 T1.3
  Bottom 0.406: 86.16,32.78 T2.1 82.89,31.19 R9.2
  Bottom 0.61: 82.6,31.32 R9.2
  Bottom 0.813: v83.47,29.29 82.6,29.29 R9.2 82.37,31.19 82.37,32.34 82.97,32.34 82.97,32.85 | v104.64,24.8 102.17,24.8 99.55,22.18 90.33,22.18 90.33,25.48 v89.82,25.99
VUSB  (via drill 0.8)
  Top 0.61: v70.86,19.3 71.17,19.3 74.11,16.61 79.31,16.61 v87.71,12.02 | v70.77,27.18 70.77,34.71 v63.32,42.41
  Bottom 0.254: 87.12,18.55 F1.2
  Bottom 0.305: U$3.7 60.21,35.17 60.21,40.39 61.77,42.38
  Bottom 0.61: 87.12,18.55 T1.1 | v87.71,12.02 87.79,12.02 86.94,12.92 87.06,13.19 88.85,13.19 89.15,13.49 89.15,15.81 86.94,18.02 F1.2 | v70.86,19.3 70.86,27.09 v70.77,27.18 | 61.77,42.38 63.46,42.38 v63.32,42.41
XTAL3
  Bottom 0.254: Y2.1 58.34,25.69 58.34,27.08 56.6,27.08 U$3.16
  Bottom 0.305: Y2.1 60.38,25.69 C4.2
XTAL4
  Bottom 0.254: Y2.3 54.53,23.39 54.53,27.08 55.8,27.08 U$3.17
  Bottom 0.305: C5.2 56.15,21.45 Y2.3

### Text on the board
tPlace: Trinity School | ^PWR^ | ^D6^ | ^D5^ | v D11 LIGHTv | OFF | vD12v | v A1 v | vD4v | + | ^A0 SENSOR ^ | v COM Breakout v | ON | vD8v | ^A2^ | - | D9 | RST | D11 | D0/RX | D1/TX | D2/SDA | D3/SCL | 5v | GND | GND | 5V | TrinTheremin | mini usb | D10 | (UART) | (I2C) | (PWR)
bPlace: ALERT: HOT> | Do not touch> | ALERT: HOT> | Do not touch> | More Info: | trintherem.in | D9 | RST | D11 | Charles Cunningham - 2017 | GND | 5V | D10 | D0 | D1 | D2 | D3 | 5V | GND